# Altium schematic sheet Other.SchDoc
size A4
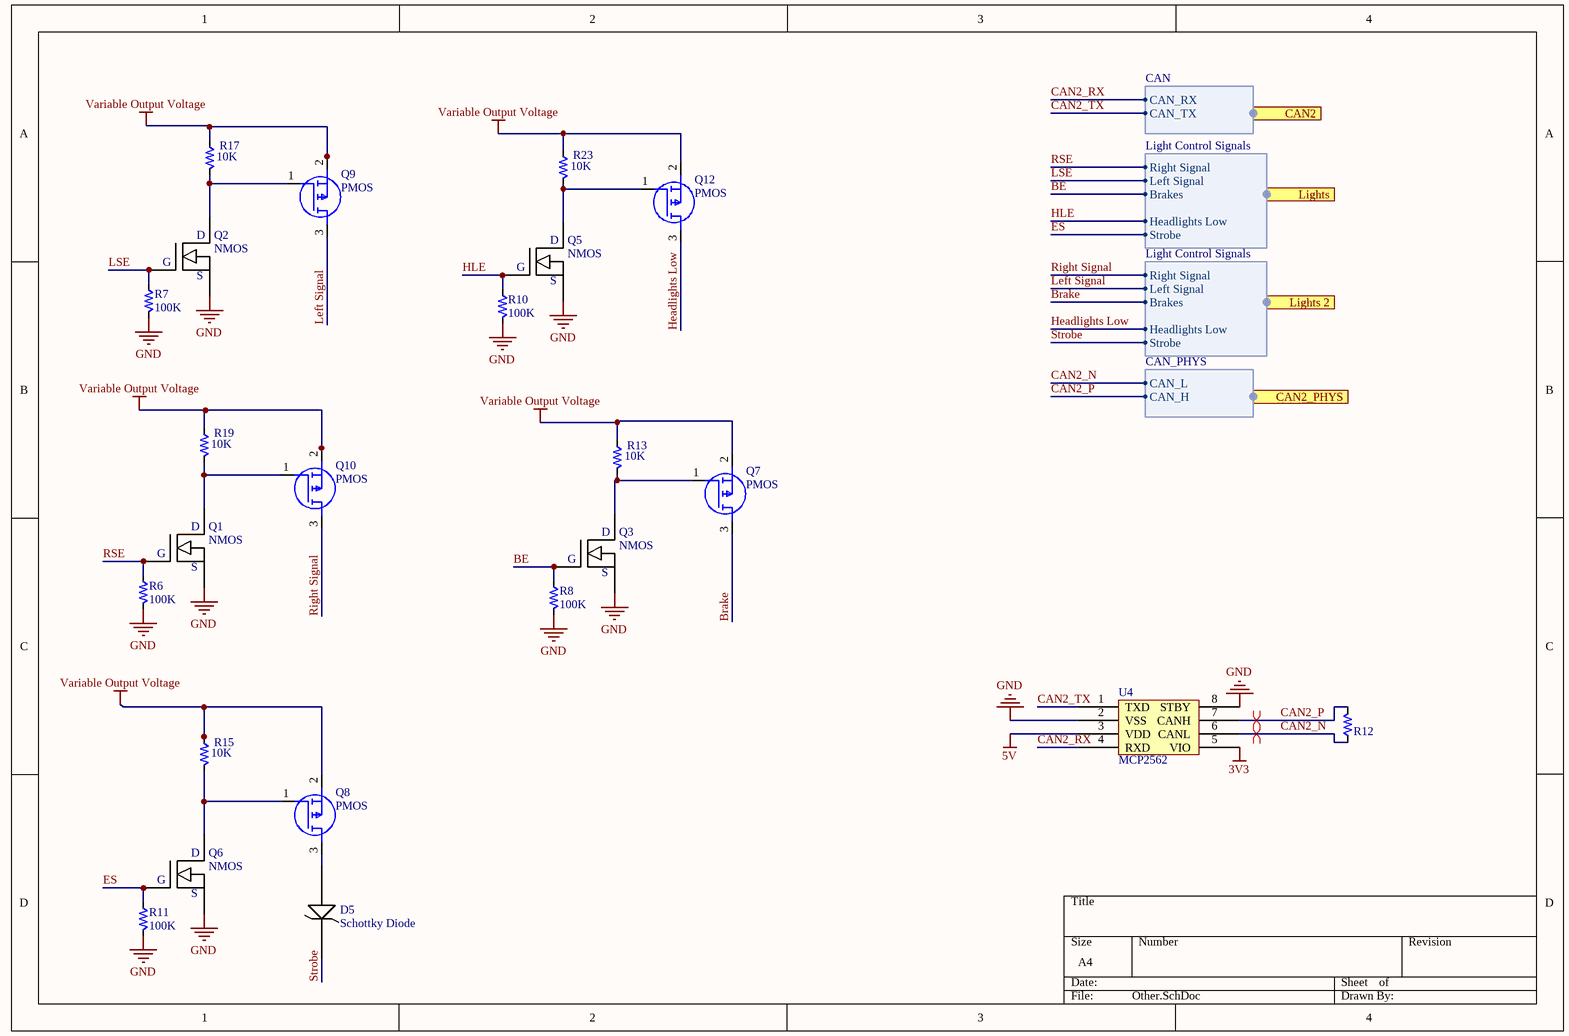
[diagram p0: Other.SchDoc]

## Parts
D5  Schottky Diode  [ON Semi Schottky Diode - MBRM110LT1G]
Q1  NMOS  [NMOS - SSM3K333R - SOTFL95P180X88-3M]
Q2  NMOS  [NMOS - SSM3K333R - SOTFL95P180X88-3M]
Q3  NMOS  [NMOS - SSM3K333R - SOTFL95P180X88-3M]
Q5  NMOS  [NMOS - SSM3K333R - SOTFL95P180X88-3M]
Q6  NMOS  [NMOS - SSM3K333R - SOTFL95P180X88-3M]
Q7  PMOS  [NMOS - SSM3K333R - SOTFL95P180X88-3M]
Q8  PMOS  [NMOS - SSM3K333R - SOTFL95P180X88-3M]
Q9  PMOS  [NMOS - SSM3K333R - SOTFL95P180X88-3M]
Q10  PMOS  [NMOS - SSM3K333R - SOTFL95P180X88-3M]
Q12  PMOS  [NMOS - SSM3K333R - SOTFL95P180X88-3M]
R6  Resistance: 100K  [PCB_GENERIC_SMD_0603]  (hidden comment: SCH_GENERIC_RESISTOR_0603)
R7  Resistance: 100K  [PCB_GENERIC_SMD_0603]  (hidden comment: SCH_GENERIC_RESISTOR_0603)
R8  Resistance: 100K  [PCB_GENERIC_SMD_0603]  (hidden comment: SCH_GENERIC_RESISTOR_0603)
R10  Resistance: 100K  [PCB_GENERIC_SMD_0603]  (hidden comment: SCH_GENERIC_RESISTOR_0603)
R11  Resistance: 100K  [PCB_GENERIC_SMD_0603]  (hidden comment: SCH_GENERIC_RESISTOR_0603)
R12  SCH_GENERIC_RESISTOR_0603  [PCB_GENERIC_SMD_0603]  (value not drawn)
R13  Resistance: 10K  [PCB_GENERIC_SMD_0603]  (hidden comment: SCH_GENERIC_RESISTOR_0603)
R15  Resistance: 10K  [PCB_GENERIC_SMD_0603]  (hidden comment: SCH_GENERIC_RESISTOR_0603)
R17  Resistance: 10K  [PCB_GENERIC_SMD_0603]  (hidden comment: SCH_GENERIC_RESISTOR_0603)
R19  Resistance: 10K  [PCB_GENERIC_SMD_0603]  (hidden comment: SCH_GENERIC_RESISTOR_0603)
R23  Resistance: 10K  [PCB_GENERIC_SMD_0603]  (hidden comment: SCH_GENERIC_RESISTOR_0603)
U4  MCP2562  [MCP2562]

## Ports
CAN2 (harness CAN), CAN2_PHYS (harness CAN_PHYS), Lights 2 (harness Light Control Signals), Lights (harness Light Control Signals)

## Harnesses
CAN_PHYS: CAN_L, CAN_H
CAN: CAN_RX, CAN_TX
Light Control Signals: Right Signal, Left Signal, Brakes, Headlights Low, Strobe

## Nets
3V3: U4.5(VIO)
5V: U4.3(VDD)
GND: Q1.2(S) Q2.2(S) Q3.2(S) Q5.2(S) Q6.2(S) R6.2 R7.2 R8.2 R10.2 R11.2 U4.2(VSS) U4.8(STBY)
Variable Output Voltage: Q7.2 Q8.2 Q9.2 Q10.2 Q12.2 R13.1 R15.1 R17.1 R19.1 R23.1
BE: Q3.1(G) R8.1 ; port Lights.Brakes
Brake: Q7.3 ; port Lights 2.Brakes
CAN2_N: R12.1 U4.6(CANL) ; port CAN2_PHYS.CAN_L
CAN2_P: R12.2 U4.7(CANH) ; port CAN2_PHYS.CAN_H
CAN2_RX: U4.4(RXD) ; port CAN2.CAN_RX
CAN2_TX: U4.1(TXD) ; port CAN2.CAN_TX
ES: Q6.1(G) R11.1 ; port Lights.Strobe
Headlights Low: Q12.3 ; port Lights 2.Headlights Low
HLE: Q5.1(G) R10.1 ; port Lights.Headlights Low
Left Signal: Q9.3 ; port Lights 2.Left Signal
LSE: Q2.1(G) R7.1 ; port Lights.Left Signal
Right Signal: Q10.3 ; port Lights 2.Right Signal
RSE: Q1.1(G) R6.1 ; port Lights.Right Signal
Strobe: D5.1 ; port Lights 2.Strobe
NetD5_2: D5.2 Q8.3
NetQ1_3: Q1.3(D) Q10.1 R19.2
NetQ2_3: Q2.3(D) Q9.1 R17.2
NetQ3_3: Q3.3(D) Q7.1 R13.2
NetQ5_3: Q5.3(D) Q12.1 R23.2
NetQ6_3: Q6.3(D) Q8.1 R15.2

## Layout directives
differential pair: CAN2_N, CAN2_P

## Library data of the parts
D5 = ON Semi Schottky Diode - MBRM110LT1G
Q1-Q3 Q5 Q6 = NMOS - SSM3K333R
Q7-Q10 Q12 = SSM3J334R,LF(T: MOSFET (P-Channel); Manufacturer_Name: Toshiba; Datasheet Link: http://toshiba.semicon-storage.com/info/docget.jsp?did=5579&prodName=SSM3J334R; Height: 0.88mm; Manufacturer_Part_Number: SSM3J334R,LF(T; RS Part Number: 1445260P; RS Price/Stock: http://uk.rs-online.com/web/p/products/1445260P
R6-R8 R10-R13 R15 R17 R19 R23 = SCH_GENERIC_RESISTOR_0603: Generic SMD resistor 0603